# EasyEDA Pro project sensorboardpcb.epro

# Board PCB4
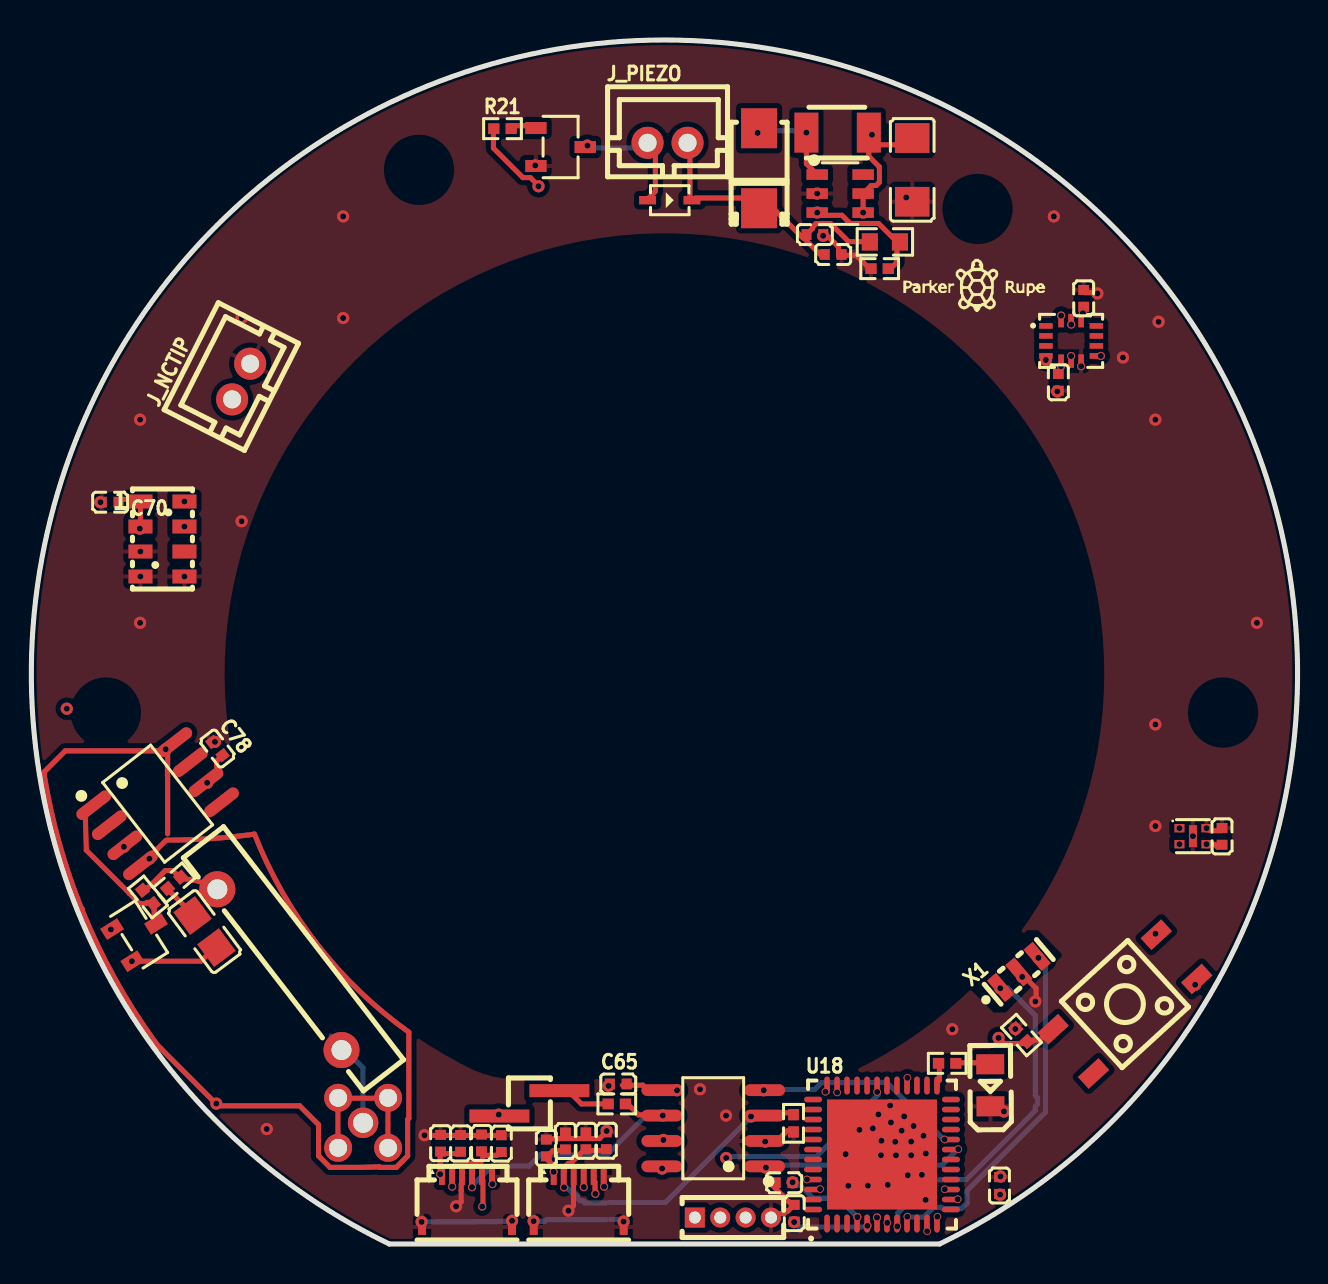
[diagram p0: board, top side]
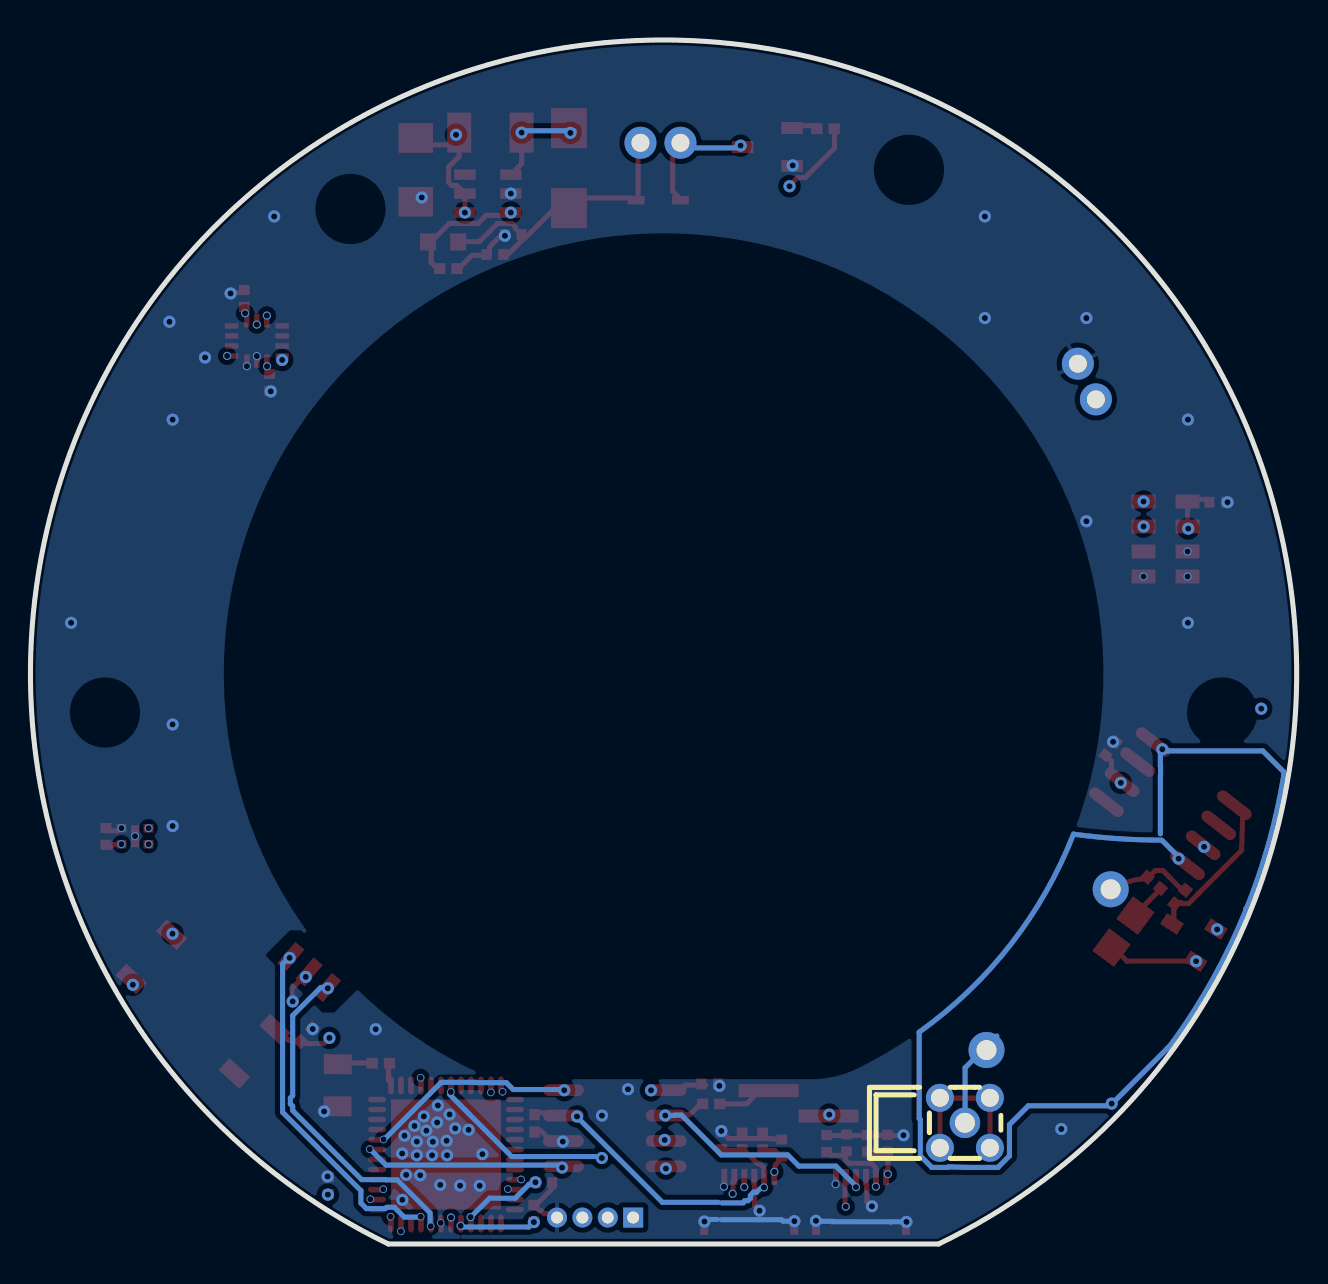
[diagram p1: board, bottom side, seen from below]

Outline 63.35 x 60.2 mm; copper layers: Top Layer, GND, 3V3, Inner3, Inner4, Bottom Layer. Coordinates in mm from the lower left corner of the outline.
Outline path: 17.91,0 45.44,0 arc(31.68,60.2) 17.91,0
Stack: Top Layer 0.035mm Outer layer thickness 1oz / Dielectric1 0.0994mm 3313 RC57% 4.2mil / GND 0.0152mm Inner layer thickness / Dielectric2 0.55mm 0.55mm H/H No copper / 3V3 0.0152mm Inner layer thickness / Dielectric3 0.1088mm 2116 RC54% 4.9mil / Inner3 0.0152mm Inner layer thickness / Dielectric4 0.55mm 0.55mm H/H No copper / Inner4 0.0152mm Inner layer thickness / Dielectric5 0.0994mm 3313 RC57% 4.2mil / Bottom Layer 0.035mm Outer layer thickness 1oz

## Design rules (mm)
template: Custom Config
spacing copperThickness1oz (default): track to track 0.051, other pairs 0 to 0.3
spacing copperThickness2oz: track to track 0.051, other pairs 0 to 0.3
track width copperThickness1oz (default): min 0.127, default 0.254, max 2.54
track width copperThickness2oz: min 0.203, default 0.254, max 2.54
differential pair differentialPair (default): width min 0.127, default 0.254, max 2.54; gap min 0.152, default 0.152
via viaSize (default): diameter min 0.2, default 0.61, max 10; hole min 0.1, default 0.305, max 6.3

## Placement (name value [footprint] x y rotation side)
C1  47uF  [C0805]  8.66 15.62 306.7 top
C44  100nF  [C0402]  37.67 3.06 180 top
C54  22uF  [C1206]  44.07 53.71 90 top
C58  100nF  [C0402]  28.77 5.16 90 top
C60  100nF  [C0402]  21.47 5.03 90 top
C62  10uF  [C0402]  23.51 5.02 270 top
C63  10uF  [C0402]  27.75 5.16 270 top
C64  10uF  [C0402]  25.77 4.8 270 top
C65  100nF  [C0402]  29.36 8 0 top
C66  10uF  [C0402]  26.72 5.15 270 top
C67  10uF  [C0402]  20.48 5.04 270 top
C68  100nF  [C0402]  38.17 1.54 90 top
C69  100nF  [C0402]  48.44 2.92 270 top
C70  100nF  [C0402]  3.94 37.09 180 top
C73  100nF  [C0402]  51.39 43.09 270 top
C74  100nF  [C0402]  52.65 47.28 90 top
C75  100nF  [C0402]  39.2 50.47 180 top
C76  10uF  [C0402]  40.12 49.48 180 top
C78  100nF  [C0402]  9.31 24.77 307.9 top
C79  100nF  [C0402]  59.57 20.38 270 top
C80  100nF  [C0402]  22.52 5.05 90 top
D1  BAV99  [SOT-23-3_L2.9-W1.3-P1.90-LS2.4-BR]  5.39 15.48 212.2 top
D2  BAV20WS-HE3-08  [SOD-323_L1.8-W1.3-LS2.7-RD]  31.94 52.19 180 top
D3  SS34  [SMA_L4.2-W2.7-LS5.0-RD]  36.41 53.79 90 top
FPC1  HC-FPC-05-09-6RLTAG  [FPC-SMD_6P-P0.50_HC-FPC-05-09-6RLTAG]  27.39 2.1 180 top
FPC2  HC-FPC-05-09-6RLTAG  [FPC-SMD_6P-P0.50_HC-FPC-05-09-6RLTAG]  21.8 2.1 180 top
H3  M50-3630242  [HDR-SMD_2P-P1.27_M50-3630242]  24.92 7.03 90 top
J_NCTIP  B2B-PH-K-S(LF)(SN)  [CONN-TH_B2B-PH-K-S]  10.5 43.12 63.1 top
J_PIEZO  B2B-PH-K-S(LF)(SN)  [CONN-TH_B2B-PH-K-S]  31.83 55.06 0 top
J_SWD1  PZ127V-11-04-0720  [HDR-TH_4P-P1.27-V-M]  35.1 1.32 0 top
L1  22uH  [IND-SMD_L3.2-W2.5]  40.34 55.57 0 top
LED5  KT-0805G  [LED0805-R-RD]  47.98 7.94 90.3 top
Q1  BSS138LT1G  [SOT-23-3_L2.9-W1.6-P1.90-LS2.8-BR]  26.48 54.85 180 top
R2  200MΩ  [RES-TH_L14.7-W2.54-P10.2-D0.8]  12.41 13.72 127.7 top
R3  1MΩ  [R0402]  7.14 18.06 220.4 top
R6  10kΩ  [R0402]  5.83 17.35 128.9 top
R18  120Ω  [R0402]  29.29 7 180 top
R19  120Ω  [R0402]  38.13 6.03 90 top
R20  1kΩ  [R0402]  45.82 9.03 0 top
R21  100Ω  [R0402]  23.57 55.77 0 top
R22  200Ω  [R0603]  42.71 50.11 180 top
R23  10kΩ  [R0402]  42.44 48.77 0 top
R24  10kΩ  [R0402]  49.54 10.45 311.8 top
SW3  SH-4.5x4.5x4.0H-TP  [SW-SMD_4P-SH-4.5X4.5X4.0H-TP]  54.72 12 222.5 top
U8  TCAN1042HVDRQ1  [SOIC-8_L4.9-W3.9-P1.27-LS6.0-BL]  34.12 5.79 90 top
U9  LMP7721MAX/NOPB  [SOIC-8_L4.9-W3.9-P1.27-LS6.0-BL]  6.32 22.02 307.9 top
U10  6GHz  [MMCX-TH_DL-MMCX-KWE]  16.6 6.06 270 bottom
U11  LSM6DSO32TR  [LGA-14_L3.0-W2.5-P0.50-TL]  52.02 45.16 0 top
U14  MS560702BA03-50  [SENSOR-SMD_MS560702BA03-50]  6.56 35.25 0 top
U15  SHT40-AD1F-R2(TOKMAS)  [DFN-4_L1.5-W1.5-P0.80-TL-EP]  58.12 20.39 0 top
U17  MT3608  [SOT-23-6_L2.9-W1.6-P0.95-LS2.8-BL]  40.47 52.52 270 top
U18  STM32G0B1CEU6  [UFQFPN-48_L7.0-W7.0-P0.50-BL-EP]  42.56 4.47 0 top
X1  8MHz  [OSC-SMD_3P-L3.2-W1.3-P1.20-L]  49.41 13.6 40.2 top

## Footprints (pads in the part's own frame, mm; a bottom-side part is the same pattern mirrored in y, then rotated)
C0402
  rect 0.5x0.54 smd: 1(-0.42,0) 2(0.42,0)
C0805
  rect 1.41x1.35 smd: 1(-1,0) 2(1,0)
C1206
  rect 1.485x1.728 smd: 1(-1.593,0) 2(1.593,0)
CONN-TH_B2B-PH-K-S
  round 1.6 hole 0.9: 1(1,0) 2(-1,0)
DFN-4_L1.5-W1.5-P0.80-TL-EP
  rect 0.505x0.42 smd: 1(-0.677,0.4) 2(-0.677,-0.4) 3(0.677,-0.4) 4(0.677,0.4)
  rect 0.4x1.1 smd: 5(0,0)
FPC-SMD_6P-P0.50_HC-FPC-05-09-6RLTAG
  rect 0.3x0.8 smd: 1(1.25,-1.25) 2(0.75,-1.25) 3(0.25,-1.25) 4(-0.25,-1.25) 5(-0.75,-1.25) 6(-1.25,-1.25)
  rect 0.4x0.8 smd: 7(-2.25,1.25) 8(2.25,1.25)
HDR-SMD_2P-P1.27_M50-3630242
  rect 0.65x3 smd: 1(-0.635,1.5) 2(0.635,-1.5)
HDR-TH_4P-P1.27-V-M
  rect 1x1 hole 0.6: 1(-1.905,0)
  round 1 hole 0.6: 2(-0.635,0) 3(0.635,0) 4(1.905,0)
IND-SMD_L3.2-W2.5
  rect 1.2x2 smd: 1(-1.562,0) 2(1.562,0)
LED0805-R-RD
  rect 1x1.399 smd: 1(1.05,0) 2(-1.05,0)
LGA-14_L3.0-W2.5-P0.50-TL
  rect 0.675x0.28 smd: 1(-1.262,0.75) 2(-1.262,0.25) 3(-1.262,-0.25) 4(-1.262,-0.75) 8(1.262,-0.75) 9(1.262,-0.25) 10(1.262,0.25) 11(1.262,0.75)
  rect 0.28x0.675 smd: 5(-0.5,-1.012) 6(0,-1.012) 7(0.5,-1.012) 12(0.5,1.012) 13(0,1.012) 14(-0.5,1.012)
MMCX-TH_DL-MMCX-KWE
  round 1.524 hole 1: 1(0,0)
  round 1.4 hole 0.9: 2(-1.25,1.25) 3(-1.25,-1.25) 4(1.25,-1.25) 5(1.25,1.25)
OSC-SMD_3P-L3.2-W1.3-P1.20-L
  rect 0.6x1.4 smd: 1(-1.199,0) 2(0,0) 3(1.199,0)
R0402
  rect 0.566x0.54 smd: 1(-0.433,0) 2(0.433,0)
R0603
  rect 0.806x0.864 smd: 1(-0.753,0) 2(0.753,0)
RES-TH_L14.7-W2.54-P10.2-D0.8
  round 1.8 hole 1: 1(-5.08,0) 2(5.08,0)
SENSOR-SMD_MS560702BA03-50
  rect 1.2x0.7 smd: 1(-1.1,1.875) 2(-1.1,0.625) 3(-1.1,-0.625) 4(-1.1,-1.875) 5(1.1,-1.875) 6(1.1,-0.625) 7(1.1,0.625) 8(1.1,1.875)
SMA_L4.2-W2.7-LS5.0-RD
  rect 2x1.8 smd: 1(-2,0) 2(2,0)
SOD-323_L1.8-W1.3-LS2.7-RD
  rect 0.845x0.42 smd: 1(-1.11,0) 2(1.11,0)
SOIC-8_L4.9-W3.9-P1.27-LS6.0-BL
  oval 0.588x2.045 smd: 1(-1.905,-2.57) 2(-0.635,-2.57) 3(0.635,-2.57) 4(1.905,-2.57) 5(1.905,2.57) 6(0.635,2.57) 7(-0.635,2.57) 8(-1.905,2.57)
SOT-23-3_L2.9-W1.3-P1.90-LS2.4-BR
  rect 1x0.65 smd: 1(1,-0.95) 2(1,0.95) 3(-1,0)
SOT-23-3_L2.9-W1.6-P1.90-LS2.8-BR
  rect 1.07x0.6 smd: 1(1.235,-0.95) 2(1.235,0.95) 3(-1.235,0)
SOT-23-6_L2.9-W1.6-P0.95-LS2.8-BL
  rect 0.532x1.072 smd: 1(-0.95,-1.149) 2(0,-1.149) 3(0.95,-1.149) 4(0.95,1.149) 5(0,1.149) 6(-0.95,1.149)
SW-SMD_4P-SH-4.5X4.5X4.0H-TP
  rect 1.4x0.8 smd: 1(-3.5,1.5) 2(3.5,1.5) 3(-3.5,-1.5) 4(3.5,-1.5)
UFQFPN-48_L7.0-W7.0-P0.50-BL-EP
  oval 0.28x0.9 smd: 1(-2.751,-3.45) 2(-2.251,-3.45) 3(-1.75,-3.45) 4(-1.25,-3.45) 5(-0.749,-3.45) 6(-0.249,-3.45) 7(0.249,-3.45) 8(0.75,-3.45) 9(1.25,-3.45) 10(1.75,-3.45) 11(2.251,-3.45) 12(2.751,-3.45) 25(2.751,3.449) 26(2.251,3.449) 27(1.75,3.449) 28(1.25,3.449) 29(0.75,3.449) 30(0.249,3.449) 31(-0.249,3.449) 32(-0.749,3.449) 33(-1.25,3.449) 34(-1.75,3.449) 35(-2.251,3.449) 36(-2.751,3.449)
  oval 0.9x0.28 smd: 13(3.45,-2.751) 14(3.45,-2.251) 15(3.45,-1.75) 16(3.45,-1.25) 17(3.45,-0.75) 18(3.45,-0.249) 19(3.45,0.249) 20(3.45,0.749) 21(3.45,1.25) 22(3.45,1.75) 23(3.45,2.251) 24(3.45,2.751) 37(-3.449,2.751) 38(-3.449,2.251) 39(-3.449,1.75) 40(-3.449,1.25) 41(-3.449,0.749) 42(-3.449,0.249) 43(-3.449,-0.249) 44(-3.449,-0.75) 45(-3.449,-1.25) 46(-3.449,-1.75) 47(-3.449,-2.251) 48(-3.449,-2.751)
  rect 5.5x5.5 smd: 49(0,0)

## Nets
3V3: C44.1 C60.1 C64.2 C65.2 C66.2 C67.2 C68.1 C69.2 C70.1 C73.1 C74.1 C78.2 C79.2 D1.1 FPC1.1 FPC2.1 J_SWD1.1 SW3.1 U8.5 U9.6 U11.5 U11.8 U11.12 U14.1 U14.2 U15.3 U18.4 U18.5 U18.6
+5V: C54.2 C58.1 C62.2 C63.2 C80.1 FPC1.2 FPC2.2 L1.2 R19.2 U8.3 U17.4 U17.5
+12V: C75.2 C76.2 D2.1 D3.1 J_PIEZO.1 R22.2
GND: C1.2 C44.2 C54.1 C58.2 C60.2 C62.1 C63.1 C64.1 C65.1 C66.1 C67.1 C68.2 C69.1 C70.2 C73.2 C74.2 C75.1 C76.1 C78.1 C79.1 C80.2 D1.2 FPC1.3 FPC1.6 FPC1.7 FPC1.8 FPC2.3 FPC2.6 FPC2.7 FPC2.8 J_NCTIP.1 J_SWD1.4 LED5.2 Q1.2 R19.1 R23.1 R24.1 U8.2 U9.3 U10.2 U10.3 U10.4 U10.5 U11.6 U11.7 U14.3 U14.4 U14.5 U15.4 U15.5 U17.2 U18.7 U18.49 X1.2
ACCEL1_INT: U18.14
ACCEL2_INT: U11.4 U18.15
BOOT0: R24.2 SW3.4 U18.36
CANFD_RX: U8.4 U18.20
CANFD_TX: U8.1 U18.19
CANH: FPC1.5 FPC2.5 H3.1 U8.7
CANL: FPC1.4 FPC2.4 R18.1 U8.6
CHARGEOUT: U9.4 U9.8 U18.11
I2C_SCL: U11.13 U14.8 U15.2 U18.45
I2C_SDA: U11.14 U14.7 U15.1 U18.46
NCTHERM_ADC: J_NCTIP.2 U18.12
OSC_IN: U18.8 X1.1
OSC_OUT: U18.9 X1.3
PIEZOCTRL: R21.1 U18.28
STB: U8.8 U18.31
SWD_CLK: J_SWD1.3 SW3.3
SWD_IO: J_SWD1.2 U18.35
$1N5814: R2.2 R3.1 R6.2
$1N5980: D1.3 R6.1 U9.1
$1N6241: C1.1 R3.2
$1N6389: R2.1 U10.1
$1N9861: D3.2 L1.1 U17.1
$1N9877: R22.1 R23.2 U17.3
$1N10012: D2.2 J_PIEZO.2 Q1.3
$1N15938: H3.2 R18.2
$1N20428: LED5.1 R20.2
$1N20714: Q1.1 R21.2
$1N26596: R20.1 U18.25

Pads without a net: SW3 2; U9 2 5 7; U11 1 2 3 9 10 11; U14 6; U17 6; U18 1 2 3 10 13 16 17 18 21 22 23 24 26 27 29 30 32 33 34 37 38 39 40 41 42 43 44 47 48

## Via types
v1: diameter 0.61, hole 0.305, Top Layer to Bottom Layer, 99 vias
v2: diameter 0.406, hole 0.305, Top Layer to Bottom Layer, 28 vias
v3: diameter 0.381, hole 0.305, Top Layer to Bottom Layer, 15 vias

## Routing (per net, layer and track width the routed paths; a pad name or vN(x,y) marks a point on that pad's centre or on a via; arc(x,y) is an arc through that point)
3V3: length 35.4
  Top Layer w0.254: 20.49,4.52 21.38,4.52 21.41,4.55 ; 25.82,4.39 26.1,4.67 26.76,4.67 ; 4.93,37.24 4.43,37.24 4.3,37.1 ; 9.56,24.44 9.27,24.15 9.27,23.5 ; 20.54,4.49 20.45,4.4 v2(20.45,3.49) 20.54,3.4 20.54,3.27 ; 58.96,19.98 59.21,19.98 59.35,19.84 ; 29.57,7.94 30.6,7.94 30.83,7.71 ; 25.66,4.38 26.09,3.94 26.09,3.61 ; U14.1 U14.2
  Inner3 w0.254: v2(42.31,1.33) 42.45,1.33 42.95,1.82 44.02,1.82 44.28,1.55 44.88,1.55 45.15,1.82 45.52,1.82 46.03,1.32 47.16,1.32 48.39,2.55
  Inner4 w0.254: v1(1.77,26.77) 1.89,26.64 1.89,20.13 arc(2.26,19.21) 2.67,18.31 arc(3.05,17.48) 3.4,16.63 arc(3.42,16.55) 3.42,16.47 arc(3.52,16.21) 3.61,15.95 3.85,15.71
  Bottom Layer w0.254: 41.81,0.85 38.41,0.85 38.2,1.06 ; 38.09,2.99 38.4,2.99 39.1,2.29 40.38,2.29 41.33,1.34
  vias: v1(3.98,15.73) v1(5.42,35.77) v1(8.8,23.06) v1(32.3,7.69) v1(38.09,3.09) v1(38.16,1.09) v1(48.47,2.47) v1(58.23,12.96) v2(26.13,3.61) v2(41.33,1.35) v2(41.83,0.91) v2(51.52,43.89) v2(52.61,46.54) v2(53.51,44.41) v2(58.8,19.99)
+5V: length 131.1
  Top Layer w0.254: 22.59,4.5 22.59,4.21 22.41,4.03 21.28,4.03 21.08,3.83 21.08,3.49 ; 28.82,4.7 28.8,4.68 27.81,4.68 ; 38.08,6.56 37.31,6.56 37.21,6.45 ; 42.17,54.96 43.56,54.96 43.95,55.35 ; 27.62,4.67 26.99,4.03 26.87,4.03 26.66,3.82 26.66,3.64 ; 23.4,4.55 23.29,4.44 22.59,4.44 ; v1(41.62,51.57) U17.5 42.02,52.93 42.27,52.93 42.43,53.09 42.43,53.85 41.9,54.38 L1.2
  Inner3 w0.254: 21.03,2.83 21.72,2.33 26.2,2.31 26.63,2.8
  Inner4 w0.254: 43.4,57.32 43.4,56.81 42.14,55.55 ; 21.07,2.88 18.22,2.88 arc(17.73,2.62) 17.24,2.88 14.45,2.88 arc(12.81,4.06) 11.25,5.35 10.78,5.82 arc(10.76,5.84) 10.74,5.86 arc(10.71,5.88) 10.69,5.9 arc(10.61,5.98) 10.51,6.03 9.98,6.56 arc(9.94,6.6) 9.89,6.63 arc(9.83,6.69) 9.77,6.75 arc(9.58,7.5) 8.81,7.4 7.63,8.57 arc(5.73,11.11) 4.1,13.83 arc(3.85,14.46) 3.63,15.11 arc(3.56,15.29) 3.5,15.48 ; 3.12,16.52 arc(2.77,17.36) 2.4,18.18 arc(1.98,19.09) 1.61,20.02 arc(0.43,28.11) 1.39,36.22 arc(1.46,36.43) 1.54,36.64 arc(8.81,48.8) 19.99,57.51 arc(20,57.51) 20,57.51 arc(31.2,59.77) 42.47,57.85 arc(42.92,57.63) 43.37,57.4 ; 3.45,15.52 arc(3.27,16) 3.09,16.49
  Bottom Layer w0.254: 27.63,2.17 27.45,2.17 27.33,2.28 27.33,2.43 27.17,2.59 27.02,2.59 26.83,2.79 ; 36,6.35 31.73,2.08 28.93,2.08 ; 28.76,2.06 27.67,2.06
  vias: v1(36.01,6.38) v1(42.06,55.46) v2(21.05,2.87) v2(26.65,2.83)
+12V: length 13.3
  Top Layer w0.254: 38.82,50.5 39.09,50.78 39.09,50.86 39.26,51.02 39.99,51.02 40.89,50.12 41.85,50.12 ; 38.73,50.22 39.55,49.4 39.68,49.4 ; 36.4,51.92 36.02,52.3 33.22,52.3 ; 32.99,52.32 32.95,52.36 32.95,54.73 ; 36.59,51.66 37.25,51.66 38.62,50.28
GND: length 59.1
  Top Layer w0.254: 37.31,5.16 37.81,5.66 38.09,5.66 ; 5.2,14.14 8.49,14.14 9.21,14.86 ; 53.2,47.59 53.18,47.57 52.69,47.57 ; 17.84,4.79 17.84,7.29 15.34,7.29 15.34,4.79 ; 21.33,1.94 21.5,2.11 21.5,2.68 21.51,2.68 21.51,2.99 21.58,3.06 ; 38.1,1.88 37.86,1.65 37.79,1.65 37.66,1.52 37.36,1.52 ; 50.27,12.18 50.27,12.78 49.66,13.4 ; 41.91,48.8 41.27,49.43 40.54,49.43 ; v1(26.87,1.66) 27.12,1.92 27.12,3.06 ; 19.82,5.43 23.51,5.43 23.54,5.39 ; 58.87,20.78 58.99,20.66 59.58,20.66 ; 37.2,2.95 37.2,2.81 38.11,1.91 ; 25.82,5.26 26.33,5.26 26.35,5.27 28.43,5.27 28.77,5.61 ; 39.85,50.39 40.39,49.85 40.39,49.38
  Inner3 w0.254: 5.15,14.06 11.76,7.45 11.76,5.69 ; 4.7,19.85 4.7,20.65 9.14,25.09 ; 18,5.06 19.29,5.06 19.56,5.33
  Bottom Layer w0.254: 28.98,1.23 29.52,1.23 v1(29.63,1.12) ; 20.3,1.11 19.53,1.11 v1(19.52,1.11) ; 20.3,1.11 23.27,1.11 23.28,1.13 ; 20.3,1.11 20.32,1.11 ; v1(24.05,1.16) 24.03,1.14 23.25,1.14 ; v1(25.13,1.14) 25.7,1.14 25.77,1.21 ; 28.77,1.21 25.77,1.21
  vias: v1(3.46,37.09) v1(4.63,19.86) v1(5.03,14.14) v1(5.44,41.22) v1(5.44,31.06) v1(9.18,25.11) v1(10.52,46.3) v1(10.52,36.14) v1(11.78,5.75) v1(15.6,51.38) v1(15.6,46.3) v1(19.67,5.44) v1(21.25,1.88) v1(25.21,53.93) v1(28.78,5.65) v1(28.88,7.91) v1(33.46,7.74) v1(34.76,6.42) v1(36.72,5.12) v1(39.32,52.52) v1(39.61,50.41) v1(40.74,4.49) v1(40.88,2.91) v1(41.43,5.71) v1(41.86,2.92) v1(42.1,5.78) v1(42.38,6.48) v1(42.53,5.16) v1(42.51,4.44) v1(42.85,2.96) v1(42.97,6.93) v1(43.01,6.08) v1(43.22,5.11) v1(43.26,4.44) v1(43.54,5.67) v1(43.67,6.38) v1(43.77,52.33) v1(43.85,3.44) v1(44.02,5.12) v1(44.02,4.44) v1(44.14,5.9) v1(44.56,3.46) v1(44.64,5.41) v1(44.75,4.53) v1(44.74,2.21) v1(46.08,10.74) v1(48.49,3.38) v1(48.66,6.63) v1(49.23,10.75) v1(49.58,13.36) v1(50.23,12.13) v1(51.16,51.38) v1(51.33,42.63) v1(53.34,47.53) v1(54.62,44.33) v1(56.24,41.22) v1(56.24,25.98) v1(56.24,20.9) v1(56.4,46.11) v1(61.32,31.06) v2(5.46,34.63) v2(5.46,33.38) v2(7.66,33.38) v2(23.07,2.99) v2(28.66,2.87) v2(52.02,44.4) v2(52.52,43.89) v2(58.12,20.39) v2(58.8,20.79) v3(42.83,1.06)
ACCEL1_INT:
  vias: v3(46.35,2.24)
ACCEL2_INT: length 45.7
  Inner4 w0.254: 50.97,14.06 46.78,9.88 46.78,5 46.85,4.94 46.85,4.55 46.78,4.48 46.78,3.82 45.73,2.77 45.73,2.73 ; 50.74,44.11 49.7,43.07 49.7,42.47 arc(49.71,42.44) 49.71,42.42 arc(54.41,29.56) 50.98,16.3 ; 50.98,14.08 50.98,16.27
  vias: v1(50.76,44.2) v3(45.7,2.74)
BOOT0: length 12.4
  Top Layer w0.254: 50.75,10.49 50.45,10.2 49.99,10.2 ; 49.69,10.02 48.68,10.02 v1(48.39,10.3)
  Inner3 w0.127: v1(48.39,10.3) 48.13,10.3 47.2,11.23 45.88,11.23 arc(45.88,11.23) 45.87,11.24 arc(43.8,9.74) 41.57,8.51 arc(41.56,8.5) 41.55,8.5 arc(40.78,8.19) 39.98,7.99 arc(39.98,7.96) 39.98,7.93 ; 39.76,7.71 39.77,7.72 40.01,7.93
  vias: v3(39.73,7.61)
CANFD_RX: length 10.2
  Bottom Layer w0.254: 36.8,7.72 39.2,7.72 39.54,8.07 41.04,8.07 41.06,8.08 42.8,8.08 45.65,5.23
  vias: v1(36.64,7.69) v3(45.69,5.23)
CANFD_TX: length 9.7
  Bottom Layer w0.254: 36.91,3.95 45.57,3.95 46.33,4.71
  vias: v1(36.75,3.82) v3(46.38,4.74)
CANH: length 19.9
  Top Layer w0.254: 22.6,3.19 22.6,1.88 ; 28.25,2.58 28.25,2.63 ; 28.2,2.68 28.2,3.1 28.17,3.13
  Inner4 w0.254: 28.19,2.61 28.09,2.71 28.09,3.04 27.83,3.3 27.5,3.3 24.46,6.35 23.48,6.35 ; 31.61,5.12 30.91,5.12 29.11,3.32 29.11,2.68 28.84,2.41 28.47,2.41 28.45,2.43 28.22,2.43 ; 22.69,1.89 22.94,1.64 25.67,1.64 26.25,1.07 27.3,1.07 28.21,1.97 28.21,2.47
  vias: v1(23.39,6.47) v1(31.62,5.2) v2(22.56,1.87) v2(28.22,2.51)
CANL: length 18.3
  Top Layer w0.254: 29.91,6.92 30.38,6.46 30.94,6.46
  Inner4 w0.254: 22.02,2.82 22.59,2.82 23.04,2.37 26.84,2.37 27.29,2.82 27.54,2.82 27.57,2.79
  Bottom Layer w0.254: 22.05,2.89 23.05,3.89 24.9,3.89 25.46,4.46 28.79,4.46 30.78,6.45 31.14,6.45 ; 31.69,6.43 31.14,6.43
  vias: v1(31.59,6.42) v2(22.05,2.84) v2(27.64,2.85)
CHARGEOUT: length 170.6
  Top Layer w0.254: 6.82,20.51 6.82,23.4 6.81,23.41 6.81,23.89 6.82,23.89 6.82,24.56 6.68,24.7 ; 9.24,7.01 6.49,9.76 arc(6.32,9.95) 6.16,10.14 arc(4.16,13.3) 2.54,16.68 ; 2.55,16.76 2.49,16.81 arc(1.4,20.04) 0.65,23.36 0.65,23.62 1.69,24.66 6.68,24.66 ; 9.34,6.91 13.42,6.91 14.37,5.97 14.37,4.4 14.94,3.83 16.46,3.83 17.41,3.86 17.44,3.83 18.25,3.83 18.83,4.4 18.83,6.22 18.89,6.28 18.89,10.59 arc(14.3,14.98) 11.16,20.5 ; 5.82,19.26 6.73,20.18 ; 6.76,20.2 arc(8.94,20.27) 11.12,20.49
  Inner4 w0.254: 9.18,6.97 9.18,6.84 arc(9.46,6.56) 9.73,6.28 ; v3(44.82,0.63) 44.61,0.43 18.12,0.43 arc(18.04,0.46) 17.97,0.49 arc(17.71,0.6) 17.45,0.7 arc(14.1,2.69) 11.02,5.08 10.53,5.57 arc(10.46,5.63) 10.41,5.69 10.35,5.69 9.73,6.31
  Bottom Layer w0.254: 6.82,20.51 6.82,23.4 6.81,23.41 6.81,23.89 6.82,23.89 6.82,24.56 6.68,24.7 ; 2.55,16.76 2.49,16.81 arc(1.4,20.04) 0.65,23.36 0.65,23.62 1.69,24.66 6.68,24.66 ; 9.24,7.01 6.49,9.76 arc(6.32,9.95) 6.16,10.14 arc(4.16,13.3) 2.54,16.68 ; 9.34,6.91 13.42,6.91 14.37,5.97 14.37,4.4 14.94,3.83 16.46,3.83 17.41,3.86 17.44,3.83 18.25,3.83 18.83,4.4 18.83,6.22 18.89,6.28 18.89,10.59 arc(14.3,14.98) 11.16,20.5 ; 5.82,19.26 6.73,20.18 ; 6.76,20.2 arc(8.94,20.27) 11.12,20.49
  vias: v1(5.9,19.27) v1(6.72,24.74) v1(9.25,7.02)
I2C_SCL: length 107.9
  Inner3 w0.127: 52.62,21.66 52.62,21.65 ; 52.62,21.65 52.6,21.64 ; 52.62,21.65 52.6,21.64 arc(52.68,21.56) 52.75,21.48 54.25,19.99 v2(57.44,19.99) ; 52.6,21.64 52.51,21.58 arc(48.22,14.08) 41.38,8.82 arc(40.33,8.44) 39.22,8.29 39.22,8.28 38.89,8.28 38.8,8.19 38.8,3.3 ; 52.6,21.64 arc(53.7,29.13) 52.19,36.55 arc(50.07,40.65) 47.14,44.22 46.96,44.4 ; 46.96,44.4 46.96,44.65 48.29,45.97 51.35,45.97 arc(51.52,45.94) 51.7,45.97 v2(52.03,45.97) ; 46.96,44.4 46.96,44.4 arc(33.42,50.49) 19.08,46.6 arc(18.95,46.51) 18.81,46.41 arc(14.57,42.41) 11.53,37.43 arc(11.39,37.23) 11.26,37.03 11.08,36.85 7.93,36.85 v1(7.66,37.13)
  vias: v3(38.81,3.23)
I2C_SDA: length 156
  Inner3 w0.127: v2(57.44,20.79) 58.95,22.3 62.3,22.3 arc(62.88,30.23) 61.44,38.06 arc(59.48,42.8) 56.77,47.15 ; 47.46,11.83 52.82,6.48 53.9,6.48 53.99,6.57 arc(59.22,13.65) 62.28,21.9 62.28,22.29 ; v3(39.47,2.75) 39.21,3 39.21,3.4 39.03,3.58 39.03,7.74 ; 39.03,7.76 39.36,8.09 39.36,8.1 ; 39.36,8.1 39.36,8.11 ; 39.36,8.1 arc(39.35,8.1) 39.35,8.1 ; 39.36,8.1 arc(40.44,8.27) 41.47,8.65 ; v1(7.66,35.88) 7.19,36.35 1.97,36.35 1.54,36.78 arc(4.24,43.48) 8.41,49.39 10.82,51.8 arc(11.92,52.73) 13.05,53.62 arc(31.68,59.78) 50.3,53.62 arc(53.77,50.62) 56.77,47.15 ; 47.47,11.81 46.27,11.81 arc(43.98,10.07) 41.47,8.66 ; v2(51.52,46.42) arc(53.31,48.05) 55.71,47.82 arc(56.25,47.5) 56.77,47.15
NCTHERM_ADC: length 96.5
  Inner4 w0.254: 10.2,42.26 14.18,42.26 14.44,42.53 arc(14.51,42.43) 14.62,42.46 arc(48.92,42.24) 41.41,8.76 arc(40.27,8.36) 39.07,8.22 38.59,8.22 38.41,8.04 38.41,7.79 42.66,3.54 43.09,3.54 43.43,3.2 43.43,2.77 44.82,1.38 45.33,1.38
  vias: v3(45.34,1.37)
OSC_IN: length 16.9
  Bottom Layer w0.254: 48.39,12.83 48.83,12.83 50.23,11.42 50.23,7.42 50.35,7.3 50.35,7 50.23,6.89 50.23,6.67 46.78,3.22 45.57,3.22 45.55,3.21 45,3.21 43.36,1.56 43.36,0.91 v3(43.33,0.88)
  vias: v1(48.48,12.79)
OSC_OUT: length 17.4
  Bottom Layer w0.254: 50.4,14.34 50.74,14 50.74,6.59 46.82,2.67 46.82,2.04 46.54,1.77 45.6,1.77 45.53,1.84 45.14,1.84 44.65,1.34 43.85,1.34
  vias: v1(50.39,14.31) v3(43.83,1.37)
PIEZOCTRL: length 71
  Top Layer w0.254: 25.41,52.87 24.97,53.32 24.59,53.32 23.12,54.79 23.12,55.77
  Inner4 w0.254: 43.79,8.25 43.79,9.7 arc(52.42,36.99) 27.19,50.5 ; 25.36,52.99 25.36,52.01 26.92,50.45 27.17,50.45
  vias: v1(25.37,52.89) v3(43.83,8.31)
STB: length 12.3
  Inner3 w0.254: 31.46,3.79 31.84,4.17 34.55,4.17
  Bottom Layer w0.254: 42.38,7.48 39.28,4.37 34.6,4.37
  vias: v1(31.56,3.77) v1(34.77,4.3) v3(42.32,7.6)
SWD_CLK: length 29.6
  Inner4 w0.127: 35.64,1.67 36.06,2.1 43.75,2.11 44.72,1.14 45.01,1.14 45.17,0.97 45.64,0.97 46.74,2.08 46.74,2.23 47.45,2.94 47.45,5.18 47.39,5.24 47.39,6.27 48.62,7.5 48.62,7.9 48.87,8.14 48.87,8.14 v1(56.25,15.51)
SWD_IO: length 10.7
  Inner3 w0.127: v3(40.32,7.58) 39.87,7.13 39.87,2.58 39.59,2.3 35.64,2.3 34.81,1.47
$1N5814: length 3.6
  Top Layer w0.254: 5.47,17.81 5.83,17.81 6.7,18.67 7.07,18.67 7.41,18.34 ; 7.61,18.25 arc(8.2,18.18) 8.75,17.97
$1N5980: length 7.6
  Top Layer w0.254: 6.01,17.08 5.78,17.08 5.72,17.02 5.41,17.02 4.89,17.54 4.89,17.55 2.75,19.69 2.75,19.72 2.7,21.47 2.84,21.61 ; 5.99,15.94 6.14,16.09 6.14,16.96 ; 2.93,21.61 2.93,21.79
$1N6241: length 1.9
  Top Layer w0.254: 7.91,16.29 7.91,16.65 6.85,17.71
$1N6389: length 5
  Bottom Layer w0.254: 15,10.4 16.59,8.81 16.59,6.04
$1N9861: length 5
  Top Layer w0.254: v1(38.78,55.57) 38.78,54.01 U17.1
  Bottom Layer w0.254: 36.15,55.67 38.68,55.67 v1(38.78,55.57)
  vias: v1(36.34,55.56)
$1N9877: length 5.8
  Top Layer w0.254: 42.9,48.68 43.31,49.09 43.31,50.03 ; 39.67,51.44 40.55,51.44 40.96,51.03 42.39,51.03 43.41,50.01
  vias: v1(39.32,51.57)
$1N10012: length 5.7
  Top Layer w0.254: 31.22,54.95 31.22,52.64 30.81,52.23
  Bottom Layer w0.254: J_PIEZO.2 30.58,54.81 28.11,54.81
  vias: v1(27.82,54.92)
$1N15938: length 2.1
  Top Layer w0.254: 28.94,7 27.52,7 27.02,7.5 27.03,7.51
$1N20428: length 1.7
  Top Layer w0.254: 46.34,9.06 48.01,9.06
$1N20714: length 1.1
  Top Layer w0.254: 25.01,55.85 24.94,55.92 23.89,55.92
$1N26596: length 0.9
  Top Layer w0.254: 45.29,8.05 45.43,8.19 45.43,8.87

## Copper pours and planes (outline as drawn; the poured copper is in the pictures)
3V3 on 3V3: 0.26,59.95 63.1,59.95 63.1,0.26 0.26,0.26
GND on Top Layer: 45.44,0 31.68,60.2 17.91,0
GND on Bottom Layer: 45.44,0 31.68,60.2 17.91,0
GND on GND: 0.26,59.95 63.1,59.95 63.1,0.26 0.26,0.26

Small or netless copper shapes (teardrops, artwork), in the pictures only: 5 on GND, 3 on 3V3
